# Altium schematic sheet pmic_cincon_brick.SchDoc
size A
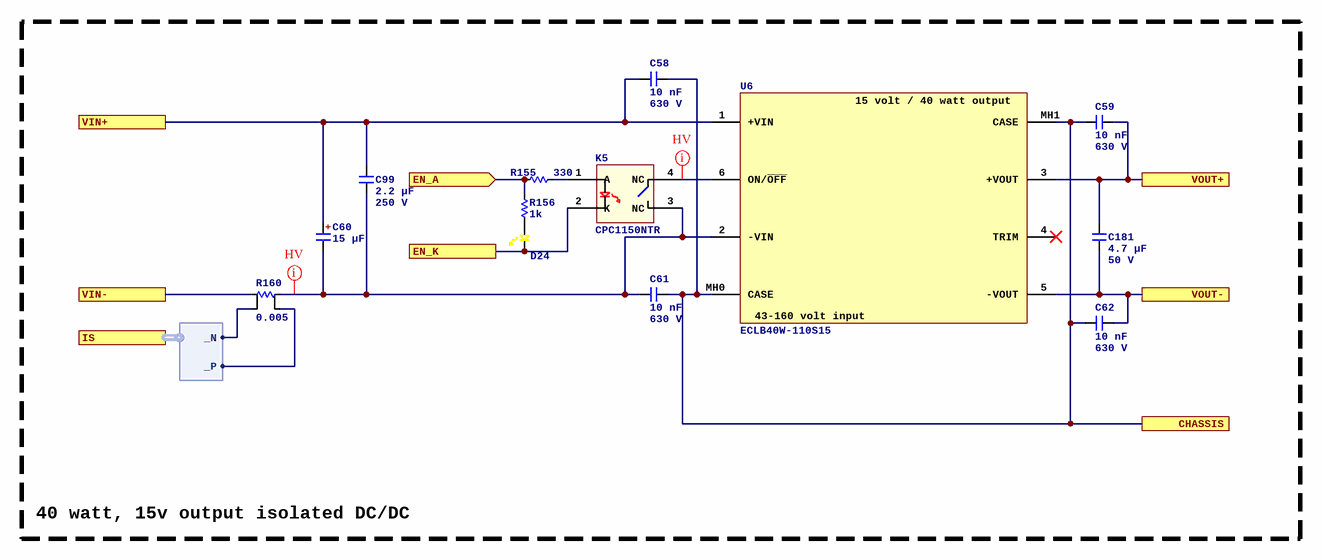
[diagram p0: pmic_cincon_brick.SchDoc]

## Parts
C58  Capacitance: 10 nF  Voltage Rating: 630 V  [KEMET_R75_40x90x130x100]  (hidden comment: R75PF21004030J)
C59  Capacitance: 10 nF  Voltage Rating: 630 V  [KEMET_R75_40x90x130x100]  (hidden comment: R75PF21004030J)
C60  Capacitance: 15 µF  [KEMET_MS_10X12]  (hidden comment: A759MS156M2CAAE094)
C61  Capacitance: 10 nF  Voltage Rating: 630 V  [KEMET_R75_40x90x130x100]  (hidden comment: R75PF21004030J)
C62  Capacitance: 10 nF  Voltage Rating: 630 V  [KEMET_R75_40x90x130x100]  (hidden comment: R75PF21004030J)
C99  Capacitance: 2.2 µF  Voltage Rating: 250 V  [C2220]  (hidden comment: C5750X7T2E225KT000N)
C181  Capacitance: 4.7 µF  Voltage Rating: 50 V  [C0805]  (hidden comment: 0805B475K500NT)
D24  LTST-C190YKT  [LED_0603P_YELLOW]  (value not drawn)
K5  CPC1150NTR  [4SMD300]
R155  value 330  [R0402]  (hidden comment: 0402WGD3300TCE)
R156  value 1k  [R0402]  (hidden comment: 0402WGF1001TCE)
R160  value 0.005  [VISHAY_WSL2726]  (hidden comment: WSL27265L000FEB)
U6  ECLB40W-110S15  [CINCON_ECLB]

## Blocks framed on the sheet
40 watt, 15v output isolated DC/DC: C58-C62 C99 C181 D24 K5 R155 R156 R160 U6

## Ports
CHASSIS, EN_A (in), EN_K, IS (harness DIFF), VIN+, VIN-, VOUT+, VOUT-

## Harnesses
DIFF: _P, _N

## Nets
CHASSIS: C58.2 C59.1 C61.2 C62.1 U6.MH0(CASE) U6.MH1(CASE) ; port CHASSIS
EN_A: R155.2 R156.1 ; port EN_A
EN_K: D24.2 K5.2(K) ; port EN_K
VIN+: C58.1 C60.1 C99.1 U6.1(+VIN) ; port VIN+
VIN-: R160.1 ; port VIN-
VOUT+: C59.2 C181.1 U6.3(+VOUT) ; port VOUT+
VOUT-: C62.2 C181.2 U6.5(-VOUT) ; port VOUT-
NetC60_2: C60.2 C61.1 C99.2 K5.3(NC) R160.2 U6.2(-VIN)
NetD24_1: D24.1 R156.2
NetK5_1: K5.1(A) R155.1
NetK5_4: K5.4(NC) U6.6(ON/~{OFF})
NetR160_3: R160.3 ; port IS._N
NetR160_4: R160.4 ; port IS._P

Not connected (* = marked no-connect by the designer): U6 4(TRIM)*

## Layout directives
net class HV: NetC60_2, NetK5_4

## Notes on the sheet
- (in symbol A759MS156M2CAAE094) +
- (in symbol ECLB40W-110S15) 15 volt / 40 watt output; 43-160 volt input

## Library data of the parts
C58 C59 C61 C62 = R75PF21004030J: Radial metallized polypropylene capacitor, 10 nF, 630 V; Manufacturer: KEMET; Manufacturer Part Number: R75PF21004030J; Supplier 2: LCSC; Supplier Part Number 2: C3796255; Supplier 1: DigiKey; Supplier Part Number 1: 399-12754-ND; Dielectric: Polypropylene; Supplier 3: Mouser; Supplier Part Number 3: 80-R75PF21004030J; ComponentLink1Description: Datasheet; ComponentLink1URL: https://yageogroup.com/content/datasheet/asset/file/KEM_F3106_R75
C60 = A759MS156M2CAAE094: Radial aluminum polymer capacitor, 15 µF, 160 V; Manufacturer: KEMET; Voltage Rating: 160 V; Manufacturer Part Number: A759MS156M2CAAE094; Supplier 1: DigiKey; Supplier Part Number 1: 399-14160-ND; Supplier 2: LCSC; Supplier Part Number 2: C599551; ComponentLink1Description: Datasheet; ComponentLink1URL: https://yageogroup.com/content/datasheet/asset/file/KEM_A4072_A759; Type: Aluminum Polymer; Supplier 3: Mouser; Supplier Part Number 3: 80-A759MS156M2CAAE94
C99 = C5750X7T2E225KT000N: Manufacturer: TDK; Dielectric: X7T; ComponentLink1URL: https://wmsc.lcsc.com/wmsc/upload/file/pdf/v2/lcsc/2304140030_TDK-C5750X7T2E225KT000N_C435266.pdf; ComponentLink1Description: Datasheet; Manufacturer Part Number: C5750X7T2E225KT000N; Package: 2220; Supplier 2: LCSC; Supplier Part Number 2: C435266
C181 = 0805B475K500NT: Manufacturer: FH (Guangdong Fenghua Advanced Tech); Dielectric: X7R; ComponentLink1URL: https://wmsc.lcsc.com/wmsc/upload/file/pdf/v2/lcsc/2204111630_FH--Guangdong-Fenghua-Advanced-Tech-0805B475K500NT_C2991173.pdf; ComponentLink1Description: Datasheet; Manufacturer Part Number: 0805B475K500NT; Package: 0805; Supplier 2: LCSC; Supplier Part Number 2: C2991173
D24 = LTST-C190YKT: LED YELLOW CLEAR 0603 SMD; Manufacturer: Lite-On Inc; Vf: 2.1 V; If: 20 mA; Supplier 1: DigiKey; ComponentLink1URL: https://mm.digikey.com/Volume0/opasdata/d220001/medias/docus/1176/LTST-C190YKT.pdf; ComponentLink1Description: Datasheet; Supplier Part Number 1: 160-1184-1-ND; Manufacturer Part Number: LTST-C190YKT; Supplier 2: LCSC; Supplier Part Number 2: C125097; LED Color: Yellow; Supplier 3: Mouser; Supplier Part Number 3: 859-LTST-C190YKT
K5 = CPC1150NTR: CPC1150N Series SPST 120 mA 350 V Single Channel Solid State Relay SMT - SOIC-4; Manufacturer: Littelfuse; Supplier 1: DigiKey; Supplier Part Number 1: 5656-CPC1150NTRCT-ND; Manufacturer Part Number: CPC1150NTR; ComponentLink1URL: https://www.littelfuse.com/media?resourcetype=datasheets&itemid=7f3e9a05-5c4a-493e-bfe5-2075df32c7f9&filename=littelfuse-integrated-circuits-cpc1150n-series-datasheet; ComponentLink1Description: Datasheet; Supplier 2: LCSC; Supplier Part Number 2: C5299824; Supplier 3: Mouser; Supplier Part Number 3: 849-CPC1150NTR
R155 = 0402WGD3300TCE: Manufacturer: UNI-ROYAL(Uniroyal Elec); Tolerance: 0.5%; Temperature Coefficient: ±100ppm/?; Power Rating (mW): 62.5; ComponentLink1Description: Datasheet; ComponentLink1URL: https://wmsc.lcsc.com/wmsc/upload/file/pdf/v2/lcsc/2411221126_UNI-ROYAL-Uniroyal-Elec-0402WGD3300TCE_C423288.pdf; Manufacturer Part Number: 0402WGD3300TCE; Package: 0402; Supplier 2: LCSC; Supplier Part Number 2: C423288
R156 = 0402WGF1001TCE: Manufacturer: UNI-ROYAL(Uniroyal Elec); Tolerance: 1%; Temperature Coefficient: ±100ppm/?; Power Rating (mW): 62.5; ComponentLink1Description: Datasheet; ComponentLink1URL: https://wmsc.lcsc.com/wmsc/upload/file/pdf/v2/lcsc/2206010216_UNI-ROYAL-Uniroyal-Elec-0402WGF1001TCE_C11702.pdf; Manufacturer Part Number: 0402WGF1001TCE; Package: 0402; Supplier 2: LCSC; Supplier Part Number 2: C11702
R160 = WSL27265L000FEB: Manufacturer: Vishay Dale; Tolerance: 1%; Power Rating (mW): 3000; Supplier 1: DigiKey; Manufacturer Part Number: WSL27265L000FEB; ComponentLink1URL: http://www.vishay.com/docs/30131/wsl2726.pdf; ComponentLink1Description: Datasheet; Supplier Part Number 1: WSLQ-.005CT-ND; Supplier 2: LCSC; Supplier Part Number 2: C1517421; Package: 2726
U6 = ECLB40W-110S15: Isolated Module DC DC Converter 1 Output 15V 2.666A 43V - 160V Input; Manufacturer: Cincon Electronics Co. LTD; Supplier 1: DigiKey; Supplier Part Number 1: 2034-3307-ND; Supplier 2: LCSC; Supplier Part Number 2: C5726884; Manufacturer Part Number: ECLB40W-110S15; ComponentLink1Description: Datasheet; ComponentLink1URL: https://www.cincon.com/productdownload/Datasheet-ECLB40W-110-series.pdf; ComponentLink2Description: Application Note; ComponentLink2URL: https://www.cincon.com/productdownload/ECLB40W-110-series-application-note.pdf; Supplier 3: Mouser; Supplier Part Number 3: 418-ECLB40110S15